# Altium schematic sheet VESC_6.SchDoc
size A4
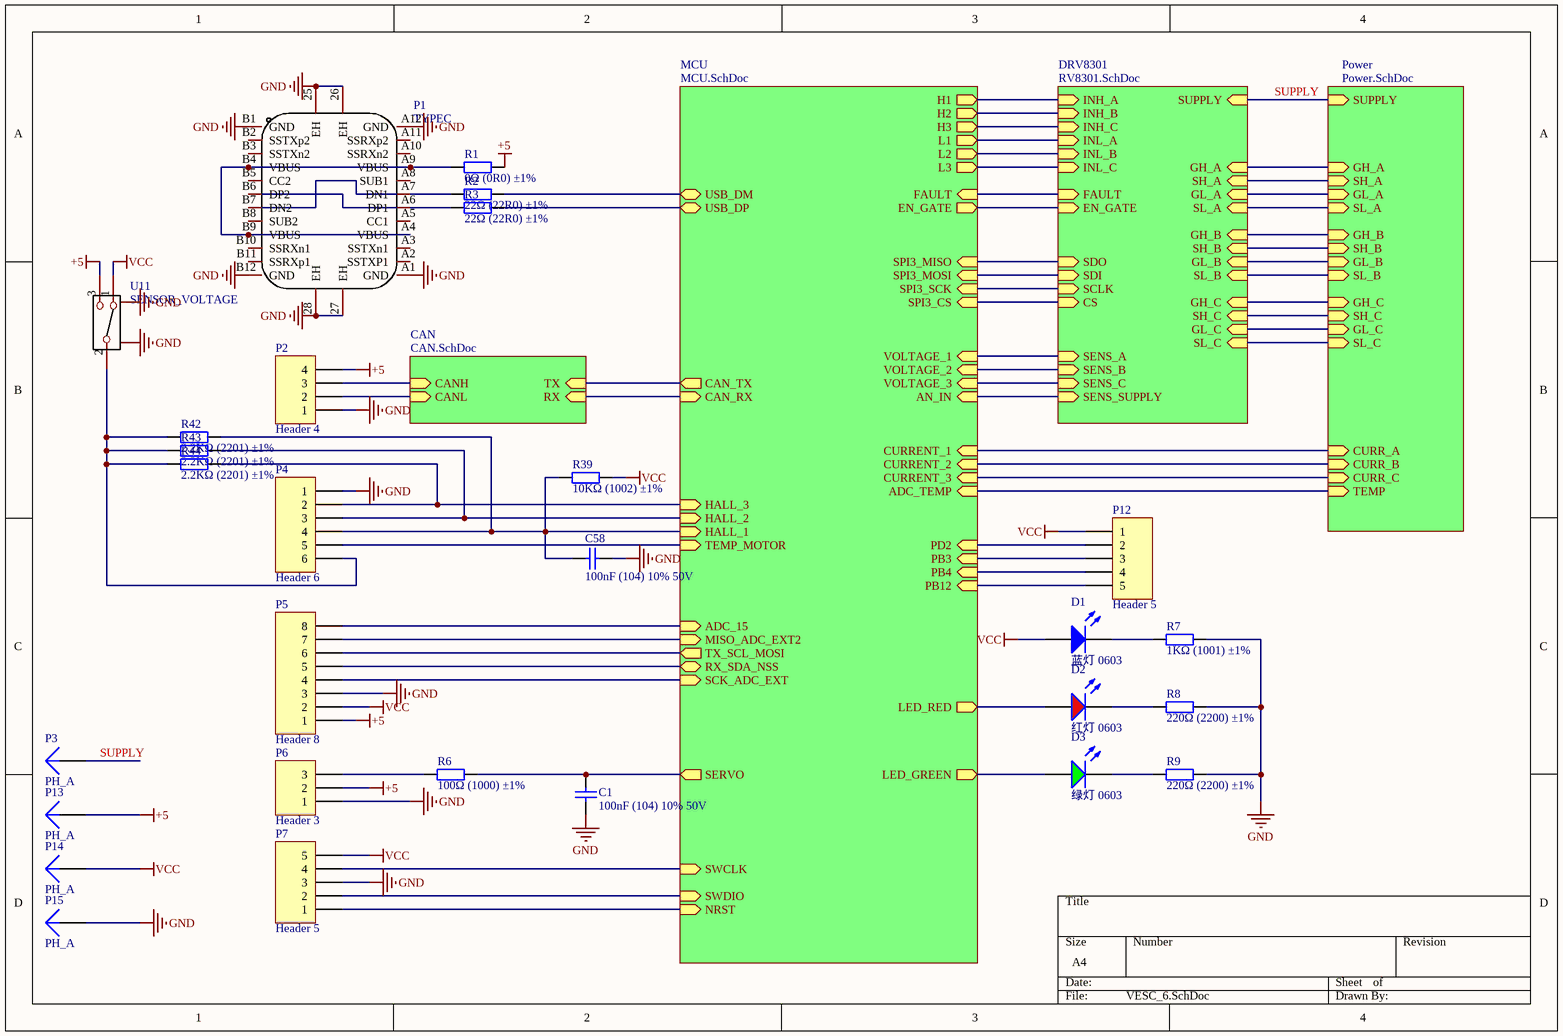
[diagram p0: VESC_6.SchDoc]

## Parts
C1  100nF (104) 10% 50V  [0603_C]
C58  100nF (104) 10% 50V  [0603_C]
D1  蓝灯 0603  [0603_LED_S1]
D2  红灯 0603  [0603_LED_S1]
D3  绿灯 0603  [0603_LED_S1]
P1  TYPEC  [USB-C-SMD_TYPE-C-3.1-FEMALE-TH-9.3]
P2  Header 4  [PH-4A]
P3  PH_A  [Test PAD-3MM]
P4  Header 6  [PH-6A]
P5  Header 8  [PH-8A]
P6  Header 3  [PH-3A]
P7  Header 5  [PH-5A]
P12  Header 5  [HDR1X5]
P13  PH_A  [Test PAD-3MM]
P14  PH_A  [Test PAD-3MM]
P15  PH_A  [Test PAD-3MM]
R1  0Ω (0R0) ±1%  [0603_R]
R2  22Ω (22R0) ±1%  [0603_R]
R3  22Ω (22R0) ±1%  [0603_R]
R6  100Ω (1000) ±1%  [0603_R]
R7  1KΩ (1001) ±1%  [0603_R]
R8  220Ω (2200) ±1%  [0603_R]
R9  220Ω (2200) ±1%  [0603_R]
R39  10KΩ (1002) ±1%  [0603_R]
R42  2.2KΩ (2201) ±1%  [0603_R]
R43  2.2KΩ (2201) ±1%  [0603_R]
R44  2.2KΩ (2201) ±1%  [0603_R]
U11  SENSOR_VOLTAGE  [SENSOR_VOLTAGE]

## Sub-sheets
CAN = CAN.SchDoc: CANL (in), CANH (in), RX (in), TX (in)
DRV8301 = RV8301.SchDoc: CS (in), INL_C (in), GL_B (in), SENS_SUPPLY (in), INH_C (in), FAULT (in), SH_A (in), SH_B (in), SENS_B (in), SL_B (in), SCLK (in), SDO (in), GH_B (in), INH_A (in), SL_C (in), INL_A (in), GL_C (in), SENS_A (in), SDI (in), EN_GATE (in), GL_A (in), GH_C (in), INL_B (in), SH_C (in), INH_B (in), SL_A (in), SUPPLY (in), SENS_C (in), GH_A (in)
MCU = MCU.SchDoc: SWCLK (in), SPI3_SCK (in), MISO_ADC_EXT2 (in), LED_RED (out), CAN_RX (in), HALL_1 (in), H2 (out), CURRENT_2 (in), L2 (out), USB_DM (bidir), LED_GREEN (out), SPI3_CS (in), SPI3_MISO (in), FAULT (in), TX_SCL_MOSI (out), PB4 (in), CAN_TX (out), SCK_ADC_EXT (in), L3 (out), SWDIO (in), HALL_2 (in), SPI3_MOSI (in), PD2 (in), EN_GATE (out), ADC_TEMP (in), CURRENT_3 (in), SERVO (out), CURRENT_1 (in), ADC_15 (in), RX_SDA_NSS (bidir), L1 (out), H1 (out), H3 (out), PB3 (in), TEMP_MOTOR (in), HALL_3 (in), PB12 (in), USB_DP (bidir), NRST (in), VOLTAGE_1 (in), VOLTAGE_3 (in), AN_IN (in), VOLTAGE_2 (in)
Power = Power.SchDoc: SUPPLY (in), GH_B (in), SL_B (in), SL_A (in), GL_A (in), CURR_A (in), GL_B (in), SH_B (in), SH_C (in), SH_A (in), CURR_B (in), GH_A (in), SL_C (in), CURR_C (in), GH_C (in), TEMP (in), GL_C (in)

## Nets
+5: P2.4 P5.1 P6.2 P13.1 R1.2 U11.3
GND: C1.1 C58.2 P1.25(EH) P1.26(EH) P1.27(EH) P1.28(EH) P1.A1(GND) P1.A12(GND) P1.B1(GND) P1.B12(GND) P2.1 P4.1 P5.3 P6.1 P7.3 P15.1 R7.2 R8.2 R9.2 U11.4 U11.5
VCC: D1.A P5.2 P7.5 P12.1 P14.1 R39.2 U11.1
SUPPLY: P3.1 ; sheet DRV8301/SUPPLY, sheet Power/SUPPLY
NetC1_2: C1.2 R6.2 ; sheet MCU/SERVO
NetC58_1: C58.1 P4.4 R39.1 R42.2 ; sheet MCU/HALL_1
NetD1_K: D1.K R7.1
NetD2_A: D2.A ; sheet MCU/LED_RED
NetD2_K: D2.K R8.1
NetD3_A: D3.A ; sheet MCU/LED_GREEN
NetD3_K: D3.K R9.1
NetP1_A4: P1.A4(VBUS) P1.A9(VBUS) P1.B4(VBUS) P1.B9(VBUS) R1.1
NetP1_A6: P1.A6(DP1) R3.1
NetP1_A7: P1.A7(DN1) R2.1
NetP2_2: P2.2 ; sheet CAN/CANL
NetP2_3: P2.3 ; sheet CAN/CANH
NetP4_2: P4.2 R44.2 ; sheet MCU/HALL_3
NetP4_3: P4.3 R43.2 ; sheet MCU/HALL_2
NetP4_5: P4.5 ; sheet MCU/TEMP_MOTOR
NetP4_6: P4.6 R42.1 R43.1 R44.1 U11.2
NetP5_4: P5.4 ; sheet MCU/SCK_ADC_EXT
NetP5_5: P5.5 ; sheet MCU/RX_SDA_NSS
NetP5_6: P5.6 ; sheet MCU/TX_SCL_MOSI
NetP5_7: P5.7 ; sheet MCU/MISO_ADC_EXT2
NetP5_8: P5.8 ; sheet MCU/ADC_15
NetP6_3: P6.3 R6.1
NetP7_1: P7.1 ; sheet MCU/NRST
NetP7_2: P7.2 ; sheet MCU/SWDIO
NetP7_4: P7.4 ; sheet MCU/SWCLK
NetP12_2: P12.2 ; sheet MCU/PD2
NetP12_3: P12.3 ; sheet MCU/PB3
NetP12_4: P12.4 ; sheet MCU/PB4
NetP12_5: P12.5 ; sheet MCU/PB12
NetR2_2: R2.2 ; sheet MCU/USB_DM
NetR3_2: R3.2 ; sheet MCU/USB_DP
(unnamed): sheet CAN/RX, sheet MCU/CAN_RX
(unnamed): sheet CAN/TX, sheet MCU/CAN_TX
(unnamed): sheet MCU/SPI3_SCK, sheet DRV8301/SCLK
(unnamed): sheet MCU/H2, sheet DRV8301/INH_B
(unnamed): sheet MCU/CURRENT_2, sheet Power/CURR_B
(unnamed): sheet MCU/L2, sheet DRV8301/INL_B
(unnamed): sheet MCU/SPI3_CS, sheet DRV8301/CS
(unnamed): sheet MCU/SPI3_MISO, sheet DRV8301/SDO
(unnamed): sheet MCU/FAULT, sheet DRV8301/FAULT
(unnamed): sheet MCU/L3, sheet DRV8301/INL_C
(unnamed): sheet MCU/SPI3_MOSI, sheet DRV8301/SDI
(unnamed): sheet MCU/EN_GATE, sheet DRV8301/EN_GATE
(unnamed): sheet MCU/ADC_TEMP, sheet Power/TEMP
(unnamed): sheet MCU/CURRENT_3, sheet Power/CURR_C
(unnamed): sheet MCU/CURRENT_1, sheet Power/CURR_A
(unnamed): sheet MCU/L1, sheet DRV8301/INL_A
(unnamed): sheet MCU/H1, sheet DRV8301/INH_A
(unnamed): sheet MCU/H3, sheet DRV8301/INH_C
(unnamed): sheet MCU/VOLTAGE_1, sheet DRV8301/SENS_A
(unnamed): sheet MCU/VOLTAGE_3, sheet DRV8301/SENS_C
(unnamed): sheet MCU/AN_IN, sheet DRV8301/SENS_SUPPLY
(unnamed): sheet MCU/VOLTAGE_2, sheet DRV8301/SENS_B
(unnamed): sheet DRV8301/GL_B, sheet Power/GL_B
(unnamed): sheet DRV8301/SH_A, sheet Power/SH_A
(unnamed): sheet DRV8301/SH_B, sheet Power/SH_B
(unnamed): sheet DRV8301/SL_B, sheet Power/SL_B
(unnamed): sheet DRV8301/GH_B, sheet Power/GH_B
(unnamed): sheet DRV8301/SL_C, sheet Power/SL_C
(unnamed): sheet DRV8301/GL_C, sheet Power/GL_C
(unnamed): sheet DRV8301/GL_A, sheet Power/GL_A
(unnamed): sheet DRV8301/GH_C, sheet Power/GH_C
(unnamed): sheet DRV8301/SH_C, sheet Power/SH_C
(unnamed): sheet DRV8301/SL_A, sheet Power/SL_A
(unnamed): sheet DRV8301/GH_A, sheet Power/GH_A

Not connected (* = marked no-connect by the designer): P1 A2(SSTXP1) A3(SSTXn1) A5(CC1) A8(SUB1) A10(SSRXn2) A11(SSRXp2) B2(SSTXp2) B3(SSTXn2) B5(CC2) B6(DP2) B7(DN2) B8(SUB2) B10(SSRXn1) B11(SSRXp1)

## Library data of the parts
C1 C58 = 0603 100nF (104) 10% 50V: 贴片电容; ComponentLink1Description: 供应商链接; ComponentLink1URL: http://www.szlcsc.com/product/details_15331.html; Package: 0603; Supplier: LC; SuppliersPartNumber: C14663
D1 = 0603 蓝灯: 发光二极管; ComponentLink1Description: 供应商链接; ComponentLink1URL: http://www.szlcsc.com/product/details_73150.html; Package: 0603; Supplier: LC; SuppliersPartNumber: C72041
D2 = 0603 红灯: 发光二极管; ComponentLink1Description: 供应商链接; ComponentLink1URL: http://www.szlcsc.com/product/details_2659.html; Package: 0603; Supplier: LC; SuppliersPartNumber: C2286
D3 = 0603 绿灯: 发光二极管; ComponentLink1Description: 供应商链接; ComponentLink1URL: http://www.szlcsc.com/product/details_73152.html; Package: 0603; Supplier: LC; SuppliersPartNumber: C72043
P2 = Header 4: Header, 4-Pin; LatestRevisionDate: 17-Jul-2002; LatestRevisionNote: Re-released for DXP Platform.; Publisher: Altium Limited
P3 P13-P15 = Plug: LatestRevisionDate: 17-Jul-2002; LatestRevisionNote: Re-released for DXP Platform.; Publisher: Altium Limited
P4 = Header 6: Header, 6-Pin; LatestRevisionDate: 17-Jul-2002; LatestRevisionNote: Re-released for DXP Platform.; Publisher: Altium Limited
P5 = Header 8: Header, 8-Pin; LatestRevisionDate: 17-Jul-2002; LatestRevisionNote: Re-released for DXP Platform.; Publisher: Altium Limited
P6 = Header 3: Header, 3-Pin; LatestRevisionDate: 17-Jul-2002; LatestRevisionNote: Re-released for DXP Platform.; Publisher: Altium Limited
P7 P12 = Header 5: Header, 5-Pin; LatestRevisionDate: 17-Jul-2002; LatestRevisionNote: Re-released for DXP Platform.; Publisher: Altium Limited
R1 = 0603 0Ω (0R0) 1%: 贴片电阻; ComponentLink1Description: 供应商链接; ComponentLink1URL: http://www.szlcsc.com/product/details_21903.html; Package: 0603; Supplier: LC; SuppliersPartNumber: C21189
R2 R3 = 0603 22Ω (22R0) 1%: 贴片电阻; ComponentLink1Description: 供应商链接; ComponentLink1URL: http://www.szlcsc.com/product/details_24078.html; Package: 0603; Supplier: LC; SuppliersPartNumber: C23345
R6 = 0603 100Ω (1000) 1%: 贴片电阻; ComponentLink1Description: 供应商链接; ComponentLink1URL: http://www.szlcsc.com/product/details_23502.html; Package: 0603; Supplier: LC; SuppliersPartNumber: C22775
R7 = 0603 1KΩ (1001) 1%: 贴片电阻; ComponentLink1Description: 供应商链接; ComponentLink1URL: http://www.szlcsc.com/product/details_21904.html; Package: 0603; Supplier: LC; SuppliersPartNumber: C21190
R8 R9 = 0603 220Ω (2200) 1%: 贴片电阻; ComponentLink1Description: 供应商链接; ComponentLink1URL: http://www.szlcsc.com/product/details_23689.html; Package: 0603; Supplier: LC; SuppliersPartNumber: C22962
R39 = 0603 10KΩ (1002) 1%: 贴片电阻; ComponentLink1Description: 供应商链接; ComponentLink1URL: http://www.szlcsc.com/product/details_26547.html; Package: 0603; Supplier: LC; SuppliersPartNumber: C25804
R42-R44 = 0603 2.2KΩ (2201) 1%: 贴片电阻; ComponentLink1Description: 供应商链接; ComponentLink1URL: http://www.szlcsc.com/product/details_4597.html; Package: 0603; Supplier: LC; SuppliersPartNumber: C4190